# EAGLE schematic TiNRS DemoCase MicPre (EAGLE 7.7.0)
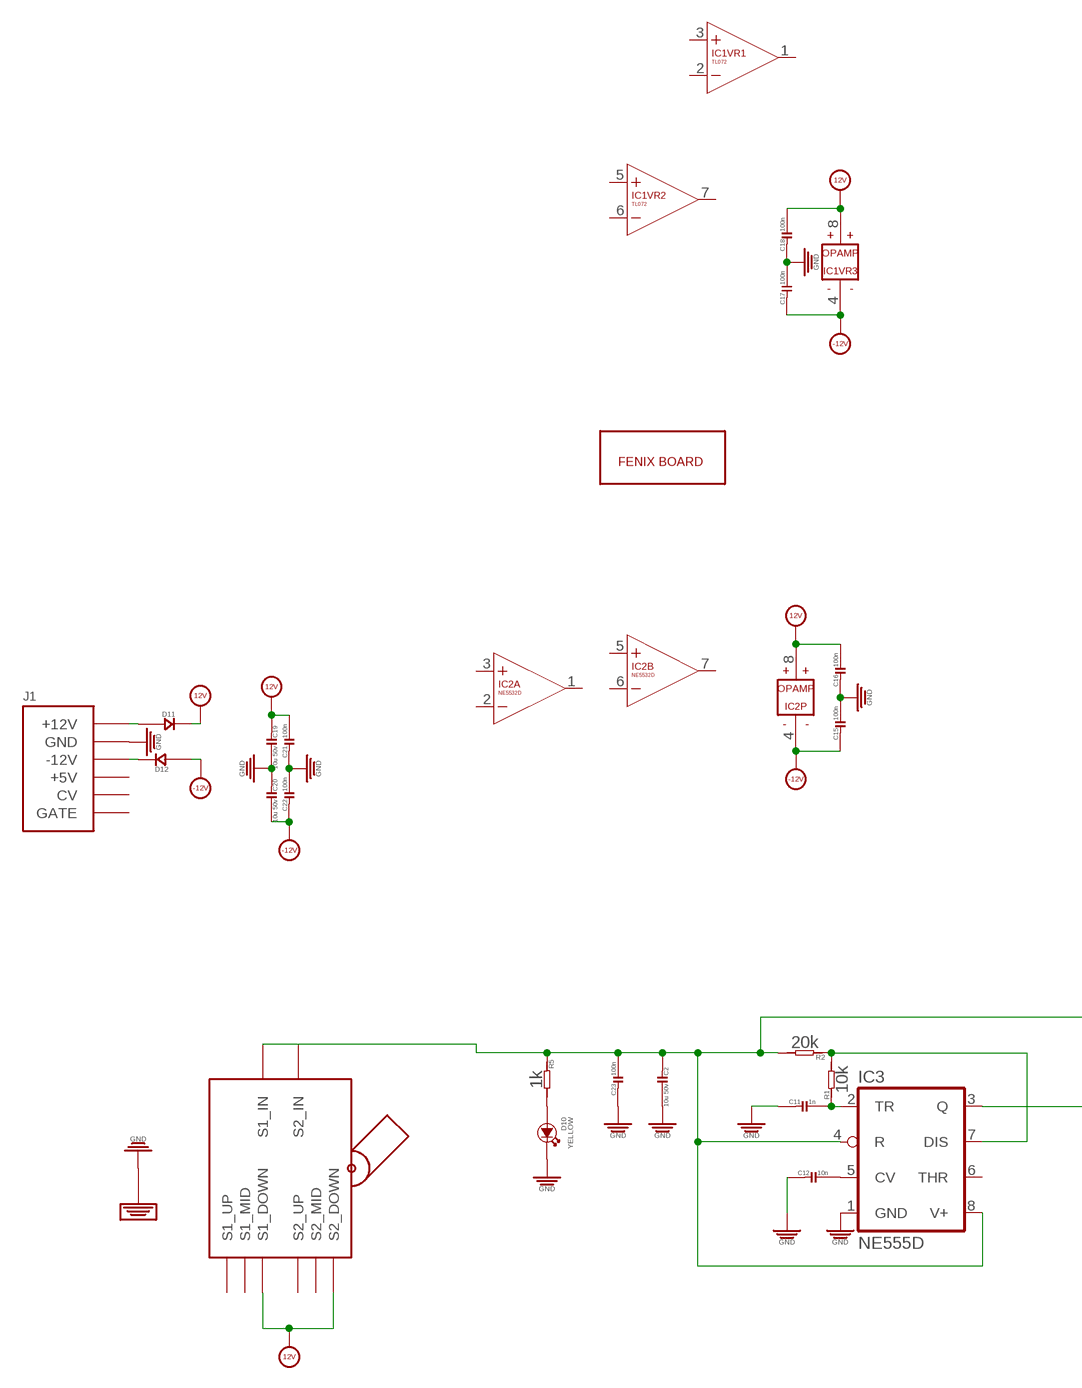
[diagram p0: schematic, sheet 1, part 1 of 2]
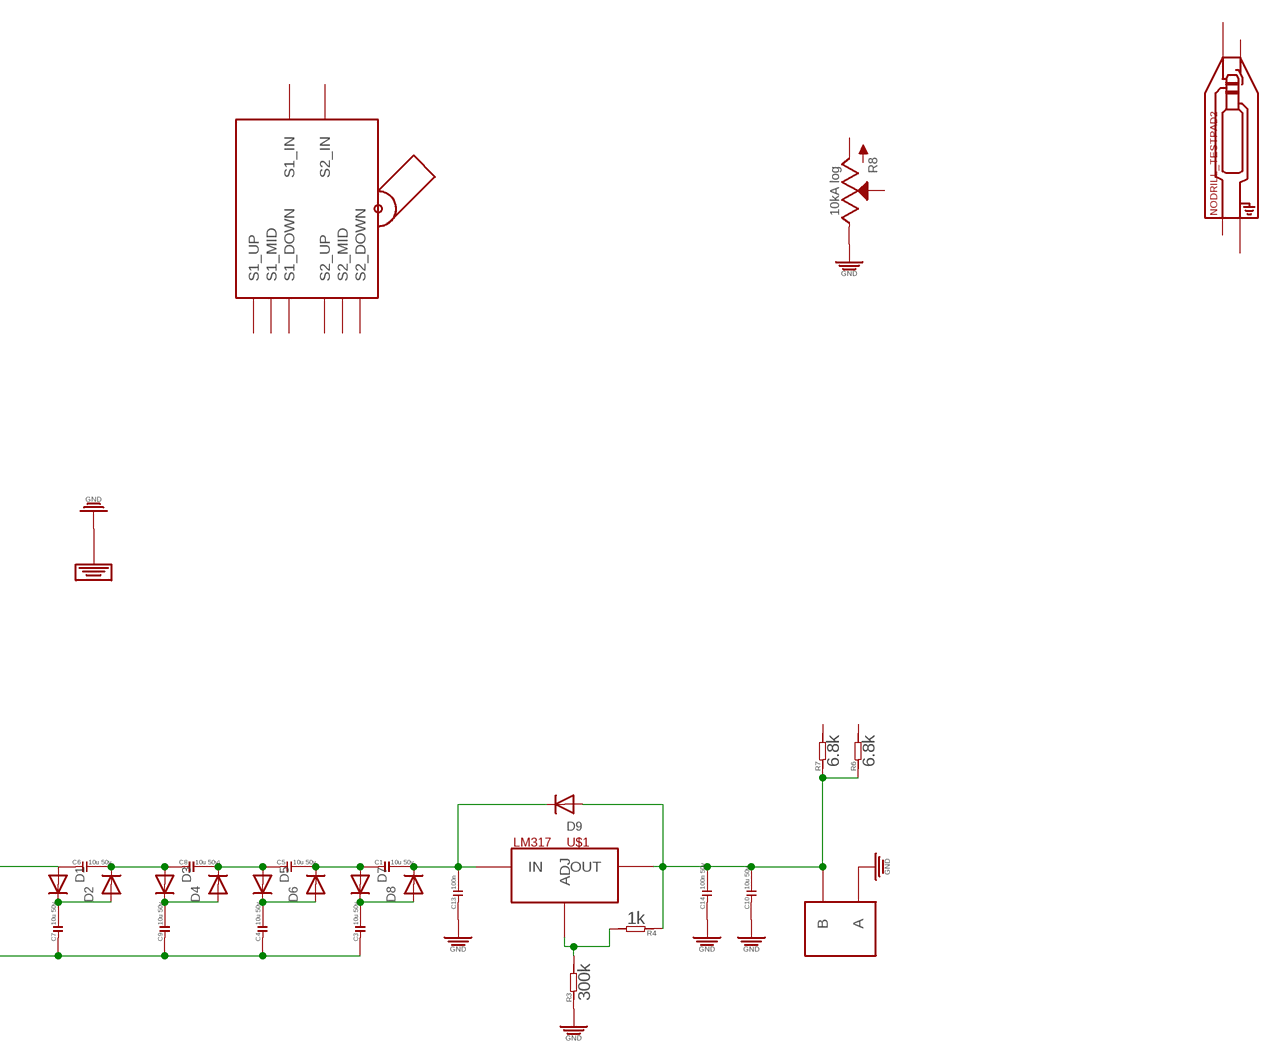
[diagram p1: schematic, sheet 1, part 2 of 2]

## Parts
C1  10u 50v  C-1206  [C3216]
C2  10u 50v  C-1206  [C3216]
C3  10u 50v  C-1206  [C3216]
C4  10u 50v  C-1206  [C3216]
C5  10u 50v  C-1206  [C3216]
C6  10u 50v  C-1206  [C3216]
C7  10u 50v  C-1206  [C3216]
C8  10u 50v\  C-1206  [C3216]
C9  10u 50v  C-1206  [C3216]
C10  10u 50v  C-1206  [C3216]
C11  1n  C-0603  [C0603]
C12  10n  C-0603  [C0603]
C13  100n  C-0603  [C0603]
C14  100n 50v  C-0603  [C0603]
C15  100n  C-0603  [C0603]
C16  100n  C-0603  [C0603]
C17  100n  C-0603  [C0603]
C18  100n  C-0603  [C0603]
C19  10u 50v  C-1206  [C3216]
C20  10u 50v  C-1206  [C3216]
C21  100n  C-0603  [C0603]
C22  100n  C-0603  [C0603]
C23  100n  C-0603  [C0603]
D1  DIODESOD-123  [SOD-123]
D2  DIODESOD-123  [SOD-123]
D3  DIODESOD-123  [SOD-123]
D4  DIODESOD-123  [SOD-123]
D5  DIODESOD-123  [SOD-123]
D6  DIODESOD-123  [SOD-123]
D7  DIODESOD-123  [SOD-123]
D8  DIODESOD-123  [SOD-123]
D9  DIODESOD-123  [SOD-123]
D10  YELLOW  LED3MM  [3MMLED]
D11  D-SMA  [DO-214AC]
D12  D-SMA  [DO-214AC]
IC1  TL072  [SO08]
IC2  NE5532D  [SO08]
IC3  NE555D  [SO08]
J1  POWER_SHROUDED_NOTEXT  [POWER_16_SHROUDED_NOTEXT]
NODRILL_TESTPAD2  AUDIO-JACK_SMALLSYMBOL  [3.5MM-JACK-SWITCH-13MM-NOHOLES-TESTPAD]
R1  10k  R-0603  [R0603]
R2  20k  R-0603  [R0603]
R3  300k  R-0603  [R0603]
R4  1k  R-0603  [R0603]
R5  1k  R-0603  [R0603]
R6  6.8k  R-0603  [R0603]
R7  6.8k  R-0603  [R0603]
R8  10kA log  POTSQUAREHOLE_SMALLKNOB  [ALPS_POT_SQUAREHOLES]
U$1  LM317  [SOT-223]
U$2  TESTPOINT_DUAL_PTH  [TESTPAD_DUAL_PTH]
U$3  TS-23E01  [TS-23E01]
U$4  TS-23E01  [TS-23E01]
U$14  FENIXBOARDS2U  [FENIX_2U_84HP]

## Nets
12V: C16.2 C18.2 C19.P$1 C21.2 D11.2(-) IC1.8(VR3:V+) IC2.8(P:V+) U$3.S1_DOWN U$3.S2_DOWN
-12V: C15.1 C17.1 C20.P$2 C22.1 D12.1(+) IC1.4(VR3:V-) IC2.4(P:V-)
GND: C2.P$2 C10.P$1 C11.1 C12.1 C13.1 C14.1 C15.2 C16.1 C17.2 C18.1 C19.P$2 C20.P$1 C21.1 C22.2 C23.1 D10.- IC3.1(GND) J1.3(GND) J1.4(GND) J1.5(GND) J1.6(GND) J1.7(GND) J1.8(GND) R3.1 R8.P$1(E) U$2.P$1(A) U$3.P$9(GND) U$3.P$10(GND) U$3.P$11(GND) U$3.P$12(GND) U$4.P$9(GND) U$4.P$10(GND) U$4.P$11(GND) U$4.P$12(GND)
N$1: C3.P$1 C4.P$1 C7.P$1 C9.P$1 IC3.3(Q)
N$2: C7.P$2 D1.C D2.A
N$3: D10.+ R5.2
N$4: C6.P$2 C8.P$1 D2.C D3.A
N$5: C9.P$2 D3.C D4.A
N$7: C5.P$1 C8.P$2 D4.C D5.A
N$8: C4.P$2 D5.C D6.A
N$10: C1.P$1 C5.P$2 D6.C D7.A
N$11: C3.P$2 D7.C D8.A
N$12: D11.1(+) J1.9(+12V) J1.10(+12V)
N$13: C1.P$2 C13.2 D8.C D9.C U$1.3(IN)
N$14: D12.2(-) J1.1(-12V) J1.2(-12V)
N$16: C12.2 IC3.5(CV)
N$17: C11.2 IC3.2(TR) R1.1
N$18: IC3.7(DIS) R1.2 R2.1
N$20: R3.2 R4.2 U$1.1(ADJ)
PHANTOM48V: C10.P$2 C14.2 D9.A R4.1 R6.1 R7.1 U$1.2(OUT) U$1.PAD(OUT) U$2.P$2(B)
PHANTOMSRC: C2.P$1 C6.P$1 C23.2 D1.A IC3.4(R) IC3.8(V+) R2.2 R5.1 U$3.S1_SRC(S1_IN) U$3.S2_SRC(S2_IN)
Unconnected: IC1.1(VR1:OUT) IC1.2(VR1:-IN) IC1.3(VR1:+IN) IC1.5(VR2:+IN) IC1.6(VR2:-IN) IC1.7(VR2:OUT) IC2.1(A:OUT) IC2.2(A:-IN) IC2.3(A:+IN) IC2.5(B:+IN) IC2.6(B:-IN) IC2.7(B:OUT) IC3.6(THR) J1.11(+5V) J1.12(+5V) J1.13(CV) J1.14(CV) J1.15(GATE) J1.16(GATE) NODRILL_TESTPAD2.RING_B@1(RING) NODRILL_TESTPAD2.RING_T@3(RING) NODRILL_TESTPAD2.SECOND_B@1(SECOND) NODRILL_TESTPAD2.SECOND_T@3(SECOND) NODRILL_TESTPAD2.SWITCH_B@1(SWITCH) NODRILL_TESTPAD2.SWITCH_T@3(SWITCH) NODRILL_TESTPAD2.TIP_B@1(TIP) NODRILL_TESTPAD2.TIP_T@3(TIP) R6.2 R7.2 R8.P$2(S) R8.P$3(A) U$3.S1_MID U$3.S1_UP U$3.S2_MID U$3.S2_UP U$4.S1_DOWN U$4.S1_MID U$4.S1_SRC(S1_IN) U$4.S1_UP U$4.S2_DOWN U$4.S2_MID U$4.S2_SRC(S2_IN) U$4.S2_UP

## Library data of the parts
C1-C23 = OPL:C*
D1-D9 = adafruit:DIODE: Diode SMADIODE - SMA Surface Mount Package 20V 1A Schottky Diode Digikey: 641-1014-6-ND DO-1N4148 - Through Hole Small Current Diode SOD-123 20V 1 A (.5mV Vf) Schottky Diode - Digikey: MBRX120TPMSCT-ND SOD-323 10V 570mA (.38mV Vf, 3ns) Schottky Diode - Digikey: ZLLS410CT-ND SOD-523 30V 30mA Schottky Diode (RB751S-40TE61) - Digikey: RB751S-40TE61CT-ND SOT23-R/W - SOT23 Package (R = Solder Paste/Reflow Ovens, W = Hand-Soldering) BAT54Film 40V 300mA - Digikey: 497-7162-1-ND
D10 = EurorackModularParts:LED*: LED; DESC: 48V
D11 D12 = OPL:D*: DIODE
IC1 = EurorackModularParts:TL072
IC2 = EurorackModularParts:NE5532: AUDIO AMPLIFIER
IC3 = adafruit:*555: TIMER Changed DIP package to have round (not oval) pin pads http://www.ladyada.net/library/pcb/eaglelibrary.html
J1 = EurorackModularParts:POWER
NODRILL_TESTPAD2 = EurorackModularParts:AUDIO-JACK_SMALLSYMBOL: Switching Mono 3.5mm Audio Jack from Erthenvar.
R1-R7 = OPL:R*
R8 = EurorackModularParts:POT
U$1 = FenixBase:LM317
U$2 = FenixBase:TESTPOINT_DUAL; DESC: 48V
U$3 U$4 = FenixBase:TS-23E01; DESC: Toggle; DOWN: 3; MID: 2; UP: 1
U$14 = EurorackModularParts:FENIXBOARDS